# EasyEDA Pro project ProPrj_FOC_AT32F413.epro, board PCB1_3
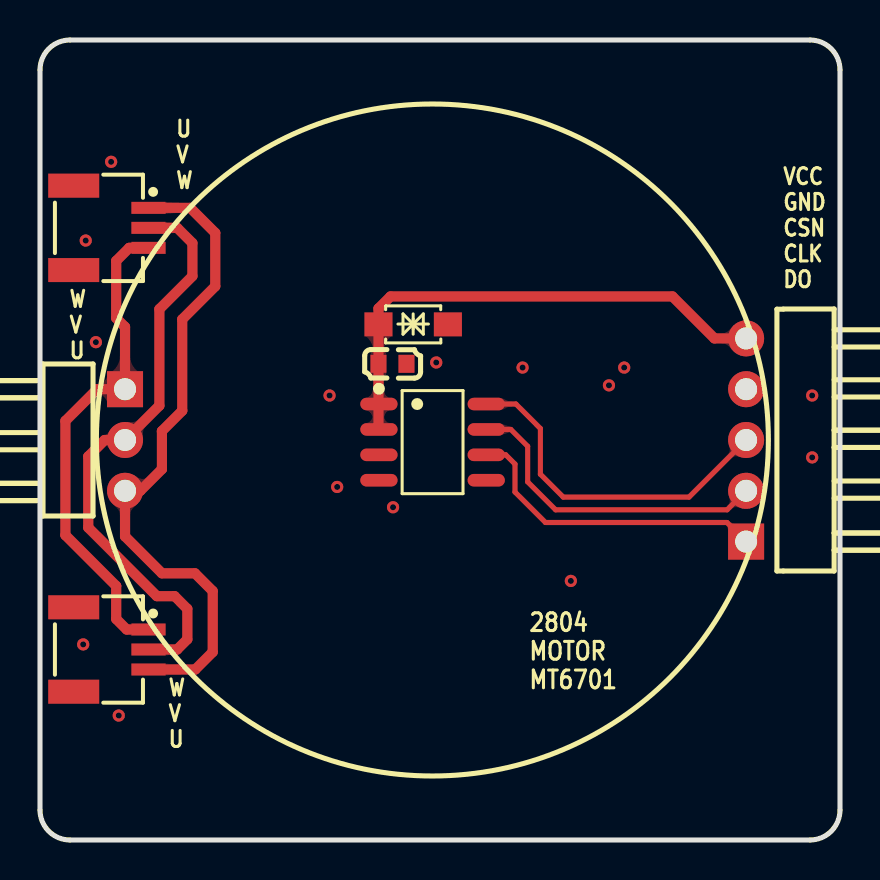
[diagram p9: board, top side]
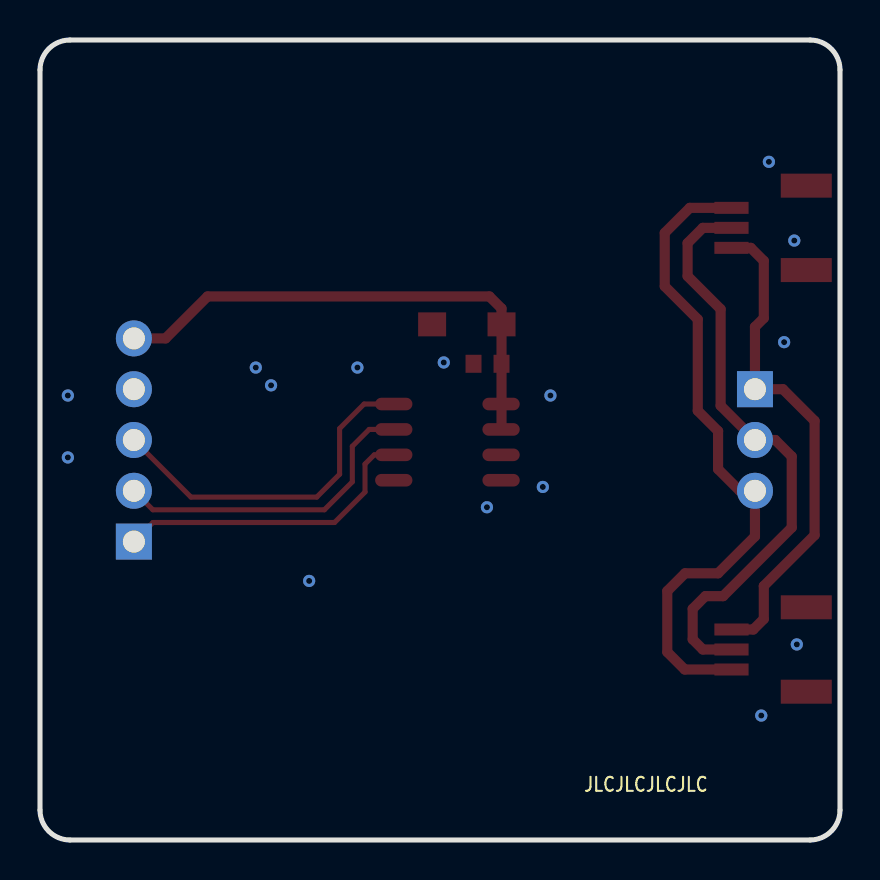
[diagram p10: board, bottom side, seen from below]

Outline 40 x 40 mm; copper layers: Top Layer, Bottom Layer. Coordinates in mm from the lower left corner of the outline.
Outline path: 0,38.5 0,1.5 arc(0.44,0.44) 1.5,0 38.5,0 arc(39.56,0.44) 40,1.5 40,38.5 arc(39.56,39.56) 38.5,40 1.5,40 arc(0.44,39.56) 0,38.5
Stack: Top Layer 0.035mm / Dielectric1 1.51mm FR4 er 4.5 / Bottom Layer 0.035mm

## Design rules (mm)
template: 自定义配置
spacing copperThickness1oz (default): track to track 0.102, other pairs 0.152 to 0.3
spacing copperThickness2oz: track to track 0.203, other pairs 0.152 to 0.3
track width copperThickness1oz (default): min 0.127, default 0.254, max 2.54
track width copperThickness2oz: min 0.203, default 0.254, max 2.54
differential pair differentialPair (default): width min 0.127, default 0.254, max 2.54; gap min 0.152, default 0.152
via viaSize (default): diameter min 0.5, default 0.61, max 10; hole min 0.3, default 0.305, max 6.299

## Placement (name value [footprint] x y rotation side)
C1  100nF  [C0603]  17.62 23.81 180 top
D1  SMF5.0CA  [SOD-123_L2.7-W1.8-LS3.7-BI]  18.66 25.78 180 top
H2  PZ254R-11-03P  [HDR-TH_3P-P2.54-H-M-W10.4]  4.25 20 270 top
H3  PZ254R-11-05P  [HDR-TH_5P-P2.54-H-M-W10.4]  35.31 20 90 top
U2  MT6701CT-STD  [SOP-8_L4.9-W3.9-P1.27-LS6.0-BL]  19.63 19.89 270 top
X1  AFC10-S03QCA-00  [CONN-SMD_AFC10-S03QCA-00]  3.56 9.52 90 top
X2  AFC10-S03QCA-00  [CONN-SMD_AFC10-S03QCA-00]  3.56 30.61 90 top

## Footprints (pads in the part's own frame, mm; a bottom-side part is the same pattern mirrored in y, then rotated)
C0603
  rect 0.8x0.9 smd: 1(-0.7,0) 2(0.7,0)
CONN-SMD_AFC10-S03QCA-00
  rect 0.6x1.71 smd: 1(1,-1.87) 2(0,-1.87) 3(-1,-1.87)
  rect 1.2x2.55 smd: 4(-2.11,1.87) 5(2.11,1.87)
HDR-TH_3P-P2.54-H-M-W10.4
  rect 1.8x1.8 hole 1.1: 1(-2.54,0)
  round 1.8 hole 1.1: 2(0,0) 3(2.54,0)
HDR-TH_5P-P2.54-H-M-W10.4
  rect 1.8x1.8 hole 1.1: 1(-5.08,0)
  round 1.8 hole 1.1: 2(-2.54,0) 3(0,0) 4(2.54,0) 5(5.08,0)
SOD-123_L2.7-W1.8-LS3.7-BI
  rect 1.4x1.2 smd: 1(-1.735,0) 2(1.735,0)
SOP-8_L4.9-W3.9-P1.27-LS6.0-BL
  oval 0.63x1.865 smd: 1(-1.905,-2.683) 2(-0.635,-2.683) 3(0.635,-2.683) 4(1.905,-2.683) 5(1.905,2.683) 6(0.635,2.683) 7(-0.635,2.683) 8(-1.905,2.683)

## Nets
As in the schematic.

Pads without a net: U2 3 5

## Via types
v1: diameter 0.61, hole 0.305, Top Layer to Bottom Layer, 15 vias

## Routing (per net, layer and track width the routed paths; a pad name or vN(x,y) marks a point on that pad's centre or on a via; arc(x,y) is an arc through that point)
GND:
  vias: v1(2.16,9.78) v1(2.29,29.97) v1(2.79,24.89) v1(3.56,33.91) v1(3.94,6.22) v1(14.48,22.22) v1(14.86,17.65) v1(17.65,16.64) v1(19.81,23.88) v1(24.13,23.62) v1(26.54,12.95) v1(28.45,22.73) v1(29.21,23.62) v1(38.61,22.22) v1(38.61,19.13)
VCC: length 25.5
  Top Layer w0.508: H3.5 33.72,25.08 31.62,27.18 17.53,27.18 16.92,26.58 D1.2 C1.2 16.92,20.53
CLK: length 16.1
  Top Layer w0.254: U2.7 23.54,20.53 24.38,19.69 24.38,17.91 25.78,16.51 34.36,16.51 H3.2
CSN: length 17.4
  Top Layer w0.254: U2.8 23.79,21.8 25.02,20.57 25.02,18.29 26.16,17.14 32.45,17.14 H3.3
DO: length 15.6
  Top Layer w0.254: H3.1 34.35,15.88 25.27,15.88 23.75,17.4 23.75,18.8 23.29,19.26 U2.6
U: length 33.5
  Top Layer w0.508: X2.1 7.51,31.61 8.76,30.35 8.76,27.69 7.11,26.03 7.11,21.46 6.1,20.45 6.1,18.54 5.01,17.46 H2.3 4.25,15.18 6.1,13.33 7.75,13.33 8.64,12.45 8.64,9.4 7.76,8.52 X1.3
V: length 29.8
  Top Layer w0.508: X1.2 6.86,9.52 7.37,10.03 7.37,11.56 6.73,12.19 5.84,12.19 2.41,15.62 2.41,19.18 3.24,20 H2.2 5.97,21.72 5.97,26.54 7.62,28.19 7.62,29.84 6.86,30.61 X2.2
W: length 24.9
  Top Layer w0.508: X1.1 4.33,10.52 3.81,11.05 3.81,12.7 1.27,15.24 1.27,20.95 2.85,22.54 4.25,22.54 4.25,25.65 3.81,26.1 3.81,28.96 4.46,29.61 X2.3

## Copper pours and planes (outline as drawn; the poured copper is in the pictures)
GND on Top Layer: -13.15,50.35 48.19,50.35 48.19,-9.72 -13.15,-9.72
GND on Bottom Layer: -9.21,46.54 53.78,46.54 53.78,-12.51 -9.21,-12.51

Small or netless copper shapes (teardrops, artwork), in the pictures only: 27 on Top Layer

## Text on the board
Bottom Silkscreen Layer: JLCJLCJLCJLC
Top Silkscreen Layer: W / V / U | U / V / W | VCC / GND / CSN / CLK / DO | 2804 / MOTOR / MT6701
